# Altium schematic sheet interface_com_usuario.SchDoc
size A4; SheetNumber: 1; SheetTotal: 4
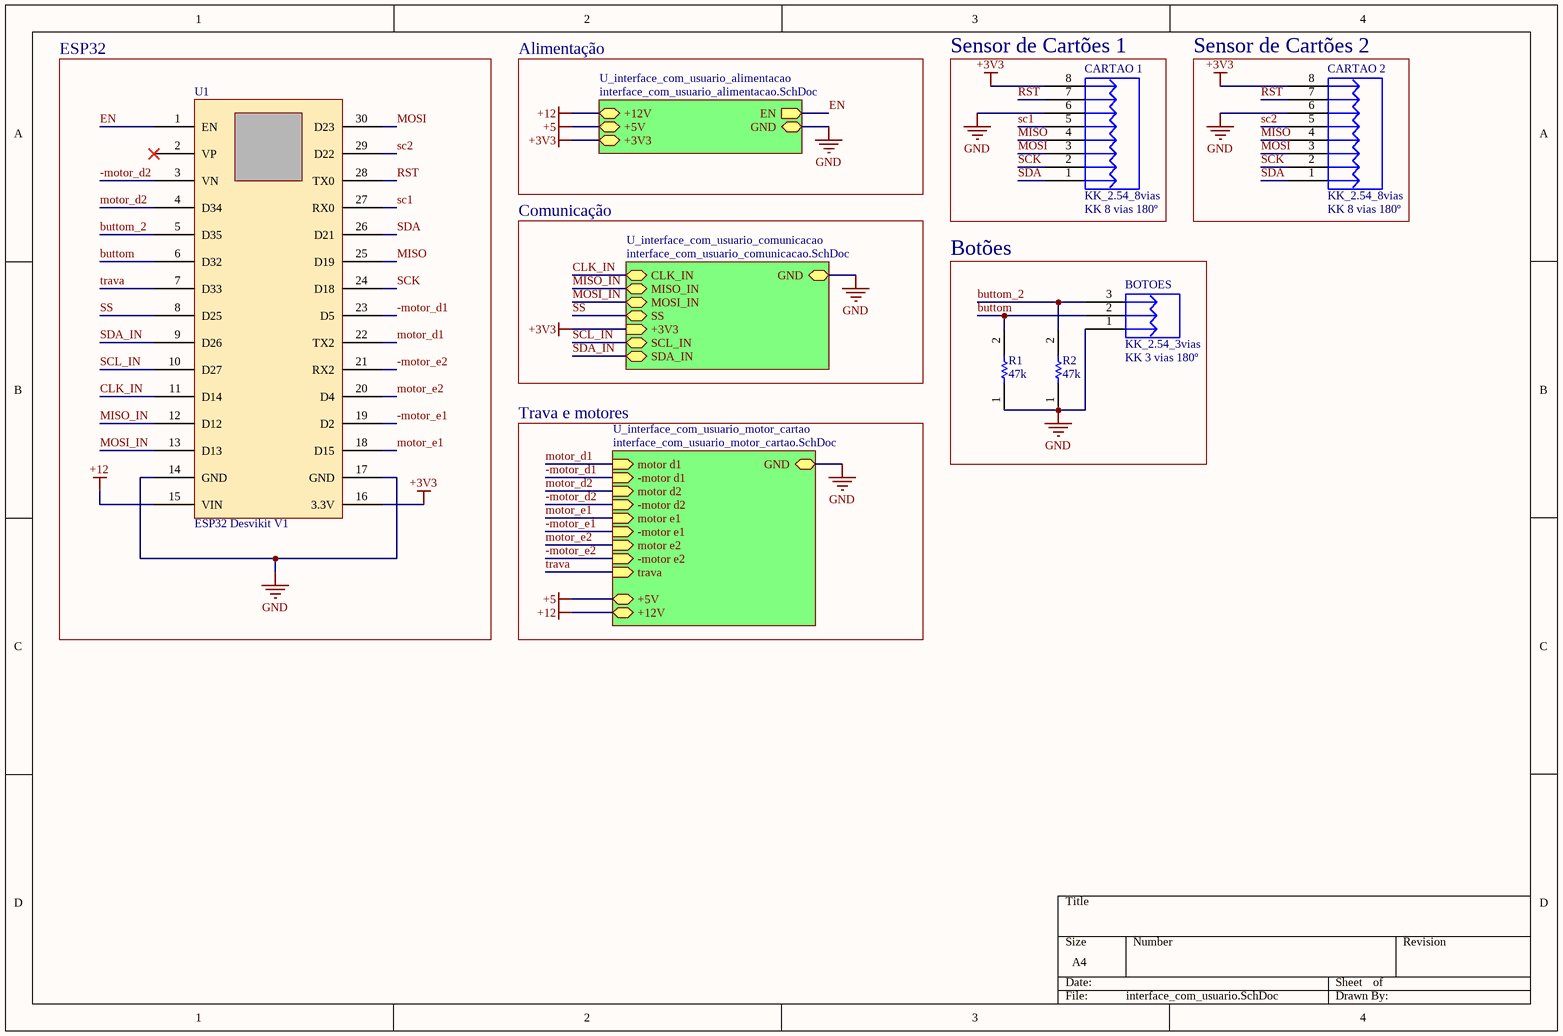
[diagram p0: interface_com_usuario.SchDoc]

## Parts
BOTOES  KK_2.54_3vias  Valor: KK 3 vias 180º  [KK_3vias_180º]
CARTAO_1  KK_2.54_8vias  Valor: KK 8 vias 180º  [KK_8vias_180°]
CARTAO_2  KK_2.54_8vias  Valor: KK 8 vias 180º  [KK_8vias_180°]
R1  47k  [RESC3216X60N]
R2  47k  [RESC3216X60N]
U1  value ESP32 Desvikit V1  [ESP32_Desvikit_v1]  (hidden comment: microcontrolador)

## Blocks framed on the sheet
ESP32: U1
Sensor de Cartões 1: CARTAO_1
Sensor de Cartões 2: CARTAO_2
Botões: BOTOES R1 R2

## Sub-sheets
U_interface_com_usuario_alimentacao = interface_com_usuario_alimentacao.SchDoc: EN (out), GND (bidir), +12V (bidir), +5V (bidir), +3V3 (bidir)
U_interface_com_usuario_comunicacao = interface_com_usuario_comunicacao.SchDoc: CLK_IN (bidir), MISO_IN (bidir), MOSI_IN (bidir), SS (bidir), GND (bidir), +3V3 (in), SCL_IN (bidir), SDA_IN (bidir)
U_interface_com_usuario_motor_cartao = interface_com_usuario_motor_cartao.SchDoc: motor d1 (in), -motor d1 (in), motor d2 (in), -motor d2 (in), motor e1 (in), -motor e1 (in), motor e2 (in), -motor e2 (in), trava (in), GND (bidir), +5V (bidir), +12V (bidir)

## Nets
+3V3: CARTAO_1.8 CARTAO_2.8 U1.16(3.3V) ; sheet U_interface_com_usuario_alimentacao/+3V3, sheet U_interface_com_usuario_comunicacao/+3V3
+5: sheet U_interface_com_usuario_alimentacao/+5V, sheet U_interface_com_usuario_motor_cartao/+5V
+12: U1.15(VIN) ; sheet U_interface_com_usuario_alimentacao/+12V, sheet U_interface_com_usuario_motor_cartao/+12V
GND: BOTOES.1 CARTAO_1.6 CARTAO_2.6 R1.1 R2.1 U1.14(GND) U1.17(GND) ; sheet U_interface_com_usuario_alimentacao/GND, sheet U_interface_com_usuario_comunicacao/GND, sheet U_interface_com_usuario_motor_cartao/GND
-motor_d1: U1.23(D5) ; sheet U_interface_com_usuario_motor_cartao/-motor d1
-motor_d2: U1.3(VN) ; sheet U_interface_com_usuario_motor_cartao/-motor d2
-motor_e1: U1.19(D2) ; sheet U_interface_com_usuario_motor_cartao/-motor e1
-motor_e2: U1.21(RX2) ; sheet U_interface_com_usuario_motor_cartao/-motor e2
buttom: BOTOES.2 R1.2 U1.6(D32)
buttom_2: BOTOES.3 R2.2 U1.5(D35)
CLK_IN: U1.11(D14) ; sheet U_interface_com_usuario_comunicacao/CLK_IN
EN: U1.1(EN) ; sheet U_interface_com_usuario_alimentacao/EN
MISO: CARTAO_1.4 CARTAO_2.4 U1.25(D19)
MISO_IN: U1.12(D12) ; sheet U_interface_com_usuario_comunicacao/MISO_IN
MOSI: CARTAO_1.3 CARTAO_2.3 U1.30(D23)
MOSI_IN: U1.13(D13) ; sheet U_interface_com_usuario_comunicacao/MOSI_IN
motor_d1: U1.22(TX2) ; sheet U_interface_com_usuario_motor_cartao/motor d1
motor_d2: U1.4(D34) ; sheet U_interface_com_usuario_motor_cartao/motor d2
motor_e1: U1.18(D15) ; sheet U_interface_com_usuario_motor_cartao/motor e1
motor_e2: U1.20(D4) ; sheet U_interface_com_usuario_motor_cartao/motor e2
RST: CARTAO_1.7 CARTAO_2.7 U1.28(TX0)
sc1: CARTAO_1.5 U1.27(RX0)
sc2: CARTAO_2.5 U1.29(D22)
SCK: CARTAO_1.2 CARTAO_2.2 U1.24(D18)
SCL_IN: U1.10(D27) ; sheet U_interface_com_usuario_comunicacao/SCL_IN
SDA: CARTAO_1.1 CARTAO_2.1 U1.26(D21)
SDA_IN: U1.9(D26) ; sheet U_interface_com_usuario_comunicacao/SDA_IN
SS: U1.8(D25) ; sheet U_interface_com_usuario_comunicacao/SS
trava: U1.7(D33) ; sheet U_interface_com_usuario_motor_cartao/trava

Not connected (* = marked no-connect by the designer): U1 2(VP)*

## Notes on the sheet
- Alimentação
- Comunicação
- Trava e motores

## Library data of the parts
BOTOES = KK_2.54_3vias: Conector KK 2.54mm 3 vias; Descrição: Conector KK 3 vias com passo 2.54mm; Encapsulamento: PTH - 180º; Modelo: 3 vias - 180º; Marca: *; Observação: *
CARTAO_1 CARTAO_2 = KK_2.54_8vias: Conector KK 2.54mm 8 vias; Descrição: Conector KK 3 vias com passo 2.54mm; Encapsulamento: PTH - 180º; Modelo: 3 vias - 180º; Marca: *; Observação: *
R1 R2 = RES 1206: RES 1206 5%; Manufacturer_Name: Vishay; Manufacturer_Part_Number: CRCW12064K70FKEA; Datasheet Link: http://docs-emea.rs-online.com/webdocs/13ec/0900766b813ecc08.pdf; Height: 0.6mm; Mouser Part Number: 71-CRCW1206-4.7K-E3; Mouser Price/Stock: https://www.mouser.co.uk/ProductDetail/Vishay-Dale/CRCW12064K70FKEA?qs=1vm4qhDHCvlKJmatsKzyFQ%3D%3D; Arrow Part Number: CRCW12064K70FKEA; Arrow Price/Stock: https://www.arrow.com/en/products/crcw12064k70fkea/vishay
U1 = ESP32 Desvikit v1: microcontrolador com moculo bluethoth e wifi